# Altium schematic sheet SFP.SchDoc: SFP
size OrCAD A; Engineer: Samer Kilani; DocumentNumber: 3; SheetNumber: 3; SheetTotal: 9
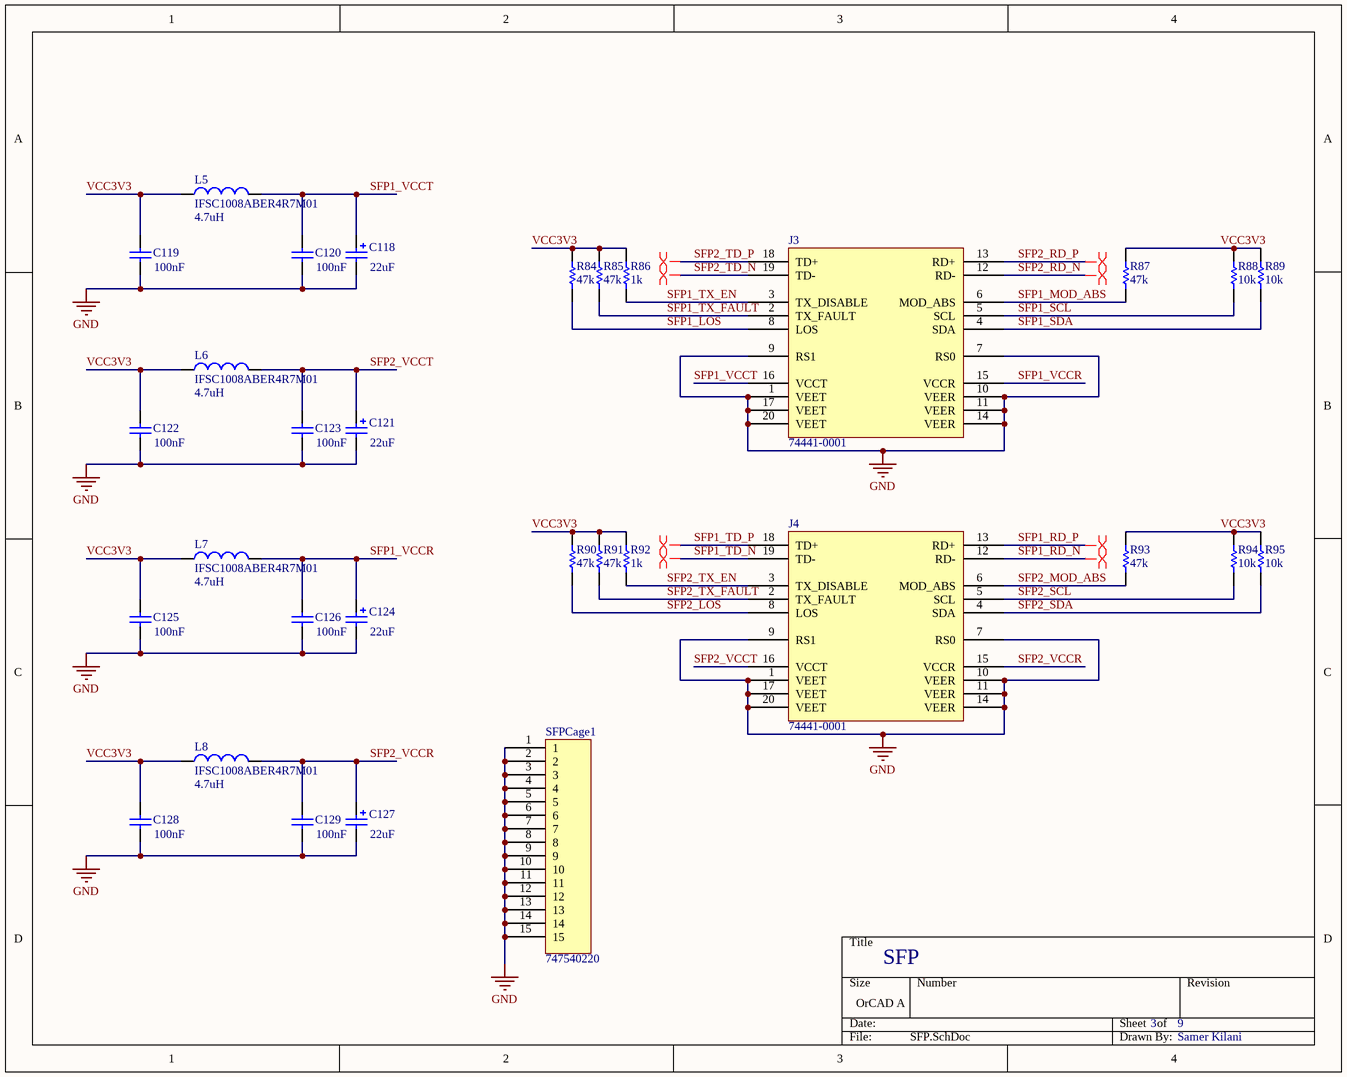
[diagram p0: SFP.SchDoc]

## Parts
C118  value 22uF  [C1206_P]
C119  value 100nF  [C0402]  (hidden comment: Cap)
C120  value 100nF  [C0402]  (hidden comment: Cap)
C121  value 22uF  [C1206_P]
C122  value 100nF  [C0402]  (hidden comment: Cap)
C123  value 100nF  [C0402]  (hidden comment: Cap)
C124  value 22uF  [C1206_P]
C125  value 100nF  [C0402]  (hidden comment: Cap)
C126  value 100nF  [C0402]  (hidden comment: Cap)
C127  value 22uF  [C1206_P]
C128  value 100nF  [C0402]  (hidden comment: Cap)
C129  value 100nF  [C0402]  (hidden comment: Cap)
J3  74441-0001  [SFP+20]
J4  74441-0001  [SFP+20]
L5  IFSC1008ABER4R7M01  value 4.7uH  [IFSC-ER]
L6  IFSC1008ABER4R7M01  value 4.7uH  [IFSC-ER]
L7  IFSC1008ABER4R7M01  value 4.7uH  [IFSC-ER]
L8  IFSC1008ABER4R7M01  value 4.7uH  [IFSC-ER]
R84  value 47k  [R0603]  (hidden comment: Res)
R85  value 47k  [R0603]  (hidden comment: Res)
R86  value 1k  [R0603]  (hidden comment: Res)
R87  value 47k  [R0603]  (hidden comment: Res)
R88  value 10k  [R0603]  (hidden comment: Res)
R89  value 10k  [R0603]  (hidden comment: Res)
R90  value 47k  [R0603]  (hidden comment: Res)
R91  value 47k  [R0603]  (hidden comment: Res)
R92  value 1k  [R0603]  (hidden comment: Res)
R93  value 47k  [R0603]  (hidden comment: Res)
R94  value 10k  [R0603]  (hidden comment: Res)
R95  value 10k  [R0603]  (hidden comment: Res)
SFPCage1  747540220  [SFPcage - dual]

## Nets
GND: C118.2 C119.1 C120.1 C121.2 C122.1 C123.1 C124.2 C125.1 C126.1 C127.2 C128.1 C129.1 J3.1(VEET) J3.7(RS0) J3.9(RS1) J3.10(VEER) J3.11(VEER) J3.14(VEER) J3.17(VEET) J3.20(VEET) J4.1(VEET) J4.7(RS0) J4.9(RS1) J4.10(VEER) J4.11(VEER) J4.14(VEER) J4.17(VEET) J4.20(VEET) SFPCage1.1 SFPCage1.2 SFPCage1.3 SFPCage1.4 SFPCage1.5 SFPCage1.6 SFPCage1.7 SFPCage1.8 SFPCage1.9 SFPCage1.10 SFPCage1.11 SFPCage1.12 SFPCage1.13 SFPCage1.14 SFPCage1.15
SFP1_LOS: J3.8(LOS) R84.2
SFP1_MOD_ABS: J3.6(MOD_ABS) R87.2
SFP1_RD_N: J4.12(RD-)
SFP1_RD_P: J4.13(RD+)
SFP1_SCL: J3.5(SCL) R88.2
SFP1_SDA: J3.4(SDA) R89.2
SFP1_TD_N: J4.19(TD-)
SFP1_TD_P: J4.18(TD+)
SFP1_TX_EN: J3.3(TX_DISABLE) R86.2
SFP1_TX_FAULT: J3.2(TX_FAULT) R85.2
SFP1_VCCR: C124.1 C126.2 J3.15(VCCR) L7.2
SFP1_VCCT: C118.1 C120.2 J3.16(VCCT) L5.2
SFP2_LOS: J4.8(LOS) R90.2
SFP2_MOD_ABS: J4.6(MOD_ABS) R93.2
SFP2_RD_N: J3.12(RD-)
SFP2_RD_P: J3.13(RD+)
SFP2_SCL: J4.5(SCL) R94.2
SFP2_SDA: J4.4(SDA) R95.2
SFP2_TD_N: J3.19(TD-)
SFP2_TD_P: J3.18(TD+)
SFP2_TX_EN: J4.3(TX_DISABLE) R92.2
SFP2_TX_FAULT: J4.2(TX_FAULT) R91.2
SFP2_VCCR: C127.1 C129.2 J4.15(VCCR) L8.2
SFP2_VCCT: C121.1 C123.2 J4.16(VCCT) L6.2
VCC3V3: C119.2 C122.2 C125.2 C128.2 L5.1 L6.1 L7.1 L8.1 R84.1 R85.1 R86.1 R87.1 R88.1 R89.1 R90.1 R91.1 R92.1 R93.1 R94.1 R95.1

## Layout directives
differential pair: SFP1_RD_N, SFP1_RD_P, SFP1_TD_N, SFP1_TD_P, SFP2_RD_N, SFP2_RD_P, SFP2_TD_N, SFP2_TD_P

## Library data of the parts
C118 C121 C124 C127 = Cap Pol: Polarized Capacitor (Surface Mount); Published: 8-Jun-2000; LatestRevisionDate: 29-May-2009; LatestRevisionNote: IPC-7351 Footprint Added.; PackageReference: C0805; Publisher: Altium Limited; PackageDescription: Chip Capacitor
C119 C120 C122 C123 C125 C126 C128 C129 = Cap: Capacitor; Published: 8-Jun-2000; LatestRevisionDate: 17-Jul-2002; LatestRevisionNote: Re-released for DXP Platform.; PackageReference: RAD-0.3; Publisher: Altium Limited; PackageDescription: Radial Cap, Thru-Hole; 2 Leads; 0.3 in Pin Spacing
J3 J4 = SFP+
L5-L8 = Inductor: Code_IEC: 1005; Published: 8-Jun-2000; LatestRevisionDate: 29-May-2009; LatestRevisionNote: IPC-7351 Footprint Added.; PackageReference: 0402-A; Publisher: Altium Limited; PackageDescription: Chip Inductor; Code_JEITA: 0402
R84-R95 = Res: Resistor
SFPCage1 = SFPcagedual